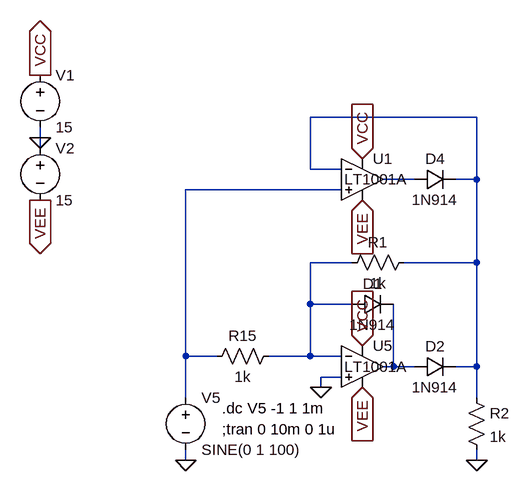
[diagram p0: schematic FullWave1.asc]
FullWave1.asc, the LTspice schematic file:
Version 4
SHEET 1 3400 680
WIRE 1456 -16 1200 -16
WIRE 784 16 784 0
WIRE 784 32 784 16
WIRE 1200 64 1200 -16
WIRE 1248 64 1200 64
WIRE 1360 80 1312 80
WIRE 1456 80 1456 -16
WIRE 1456 80 1424 80
WIRE 1248 96 1008 96
WIRE 1264 208 1200 208
WIRE 1456 208 1456 80
WIRE 1456 208 1344 208
WIRE 1200 272 1200 208
WIRE 1264 272 1200 272
WIRE 1008 352 1008 96
WIRE 1056 352 1008 352
WIRE 1200 352 1200 272
WIRE 1200 352 1136 352
WIRE 1248 352 1200 352
WIRE 1328 368 1328 272
WIRE 1328 368 1312 368
WIRE 1360 368 1328 368
WIRE 1456 368 1456 208
WIRE 1456 368 1424 368
WIRE 1248 384 1216 384
WIRE 1216 400 1216 384
WIRE 1008 416 1008 352
WIRE 1456 416 1456 368
WIRE 1008 512 1008 496
WIRE 1456 512 1456 496
FLAG 784 16 0
FLAG 1008 512 0
FLAG 784 -80 VCC
IOPIN 784 -80 Out
FLAG 1280 336 VCC
IOPIN 1280 336 In
FLAG 784 112 VEE
IOPIN 784 112 Out
FLAG 1280 400 VEE
IOPIN 1280 400 In
FLAG 1216 400 0
FLAG 1280 48 VCC
IOPIN 1280 48 In
FLAG 1280 112 VEE
IOPIN 1280 112 In
FLAG 1456 512 0
SYMBOL voltage 784 -96 R0
WINDOW 123 0 0 Left 2
WINDOW 39 0 0 Left 2
SYMATTR InstName V1
SYMATTR Value 15
SYMBOL voltage 784 16 R0
WINDOW 123 0 0 Left 2
WINDOW 39 0 0 Left 2
SYMATTR InstName V2
SYMATTR Value 15
SYMBOL Opamps\\LT1001A 1280 304 R0
WINDOW 3 -28 64 Left 2
SYMATTR InstName U5
SYMBOL res 1040 368 R270
WINDOW 0 32 56 VTop 2
WINDOW 3 0 56 VBottom 2
SYMATTR InstName R15
SYMATTR Value 1k
SYMBOL voltage 1008 400 R0
WINDOW 123 0 0 Left 2
WINDOW 39 0 0 Left 2
SYMATTR InstName V5
SYMATTR Value SINE(0 1 100)
SYMBOL diode 1264 288 R270
WINDOW 0 32 32 VTop 2
WINDOW 3 0 32 VBottom 2
SYMATTR InstName D1
SYMATTR Value 1N914
SYMBOL res 1248 224 R270
WINDOW 0 32 56 VTop 2
WINDOW 3 0 56 VBottom 2
SYMATTR InstName R1
SYMATTR Value 1k
SYMBOL diode 1360 384 R270
WINDOW 0 32 32 VTop 2
WINDOW 3 0 32 VBottom 2
SYMATTR InstName D2
SYMATTR Value 1N914
SYMBOL Opamps\\LT1001A 1280 16 R0
WINDOW 3 -28 64 Left 2
SYMATTR InstName U1
SYMBOL diode 1360 96 R270
WINDOW 0 32 32 VTop 2
WINDOW 3 0 32 VBottom 2
SYMATTR InstName D4
SYMATTR Value 1N914
SYMBOL res 1440 400 R0
SYMATTR InstName R2
SYMATTR Value 1k
TEXT 1064 432 Left 2 !.dc V5 -1 1 1m
TEXT 1064 464 Left 2 !;tran 0 10m 0 1u

The netlist it stands for:
* FullWave1.asc
V1 VCC 0 15
V2 0 VEE 15
XU5 0 N004 VCC VEE N005 LT1001  ; LT1001A, pins In+ In- V+ V- OUT
R15 N003 N004 1k
V5 N003 0 SINE(0 1 100)
D1 N004 N005 1N914
R1 N004 N001 1k
D2 N005 N001 1N914
XU1 N003 N001 VCC VEE N002 LT1001  ; LT1001A, pins In+ In- V+ V- OUT
D4 N002 N001 1N914
R2 N001 0 1k
.model D D
.lib standard.dio
.dc V5 -1 1 1m
;tran 0 10m 0 1u
.lib LTC.lib
.backanno
.end